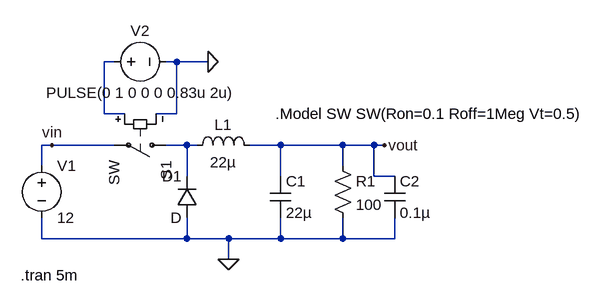
[diagram p0: schematic buck_converter_ideal_SW.asc]
buck_converter_ideal_SW.asc, the LTspice schematic file:
Version 4
SHEET 1 928 680
WIRE 80 16 64 16
WIRE 176 16 160 16
WIRE 224 16 176 16
WIRE 64 96 64 16
WIRE 96 96 64 96
WIRE 176 96 176 16
WIRE 176 96 144 96
WIRE -16 144 -32 144
WIRE 80 144 -16 144
WIRE 192 144 160 144
WIRE 208 144 192 144
WIRE 336 144 288 144
WIRE 432 144 336 144
WIRE 480 144 432 144
WIRE 496 144 480 144
WIRE -32 176 -32 144
WIRE 432 176 432 144
WIRE 192 192 192 144
WIRE 336 192 336 144
WIRE 480 192 480 144
WIRE 512 192 480 192
WIRE -32 288 -32 256
WIRE 192 288 192 256
WIRE 192 288 -32 288
WIRE 256 288 192 288
WIRE 336 288 336 256
WIRE 336 288 256 288
WIRE 432 288 432 256
WIRE 432 288 336 288
WIRE 512 288 512 256
WIRE 512 288 432 288
WIRE 256 320 256 288
FLAG 256 320 0
FLAG -16 144 vin
FLAG 496 144 vout
FLAG 224 16 0
SYMBOL ind 192 160 R270
WINDOW 0 32 56 VTop 2
WINDOW 3 5 56 VBottom 2
SYMATTR InstName L1
SYMATTR Value 22µ
SYMATTR SpiceLine Rser=1
SYMBOL cap 320 192 R0
SYMATTR InstName C1
SYMATTR Value 22µ
SYMBOL voltage -32 160 R0
WINDOW 123 0 0 Left 2
WINDOW 39 0 0 Left 2
SYMATTR InstName V1
SYMATTR Value 12
SYMBOL voltage 64 16 R270
WINDOW 0 32 56 VTop 2
WINDOW 3 -32 56 VBottom 2
WINDOW 123 0 0 Left 2
WINDOW 39 0 0 Left 2
SYMATTR InstName V2
SYMATTR Value PULSE(0 1 0 0 0 0.83u 2u)
SYMBOL res 416 160 R0
SYMATTR InstName R1
SYMATTR Value 100
SYMBOL diode 208 256 R180
WINDOW 0 24 64 Left 2
WINDOW 3 24 0 Left 2
SYMATTR InstName D1
SYMBOL cap 496 192 R0
SYMATTR InstName C2
SYMATTR Value 0.1µ
SYMBOL sw 176 144 R90
SYMATTR InstName S1
TEXT -64 344 Left 2 !.tran 5m
TEXT 328 96 Left 2 !.Model SW SW(Ron=0.1 Roff=1Meg Vt=0.5)

The netlist it stands for:
* buck_converter_ideal_SW.asc
L1 N002 vout 22µ Rser=1
C1 vout 0 22µ
V1 vin 0 12
V2 N001 0 PULSE(0 1 0 0 0 0.83u 2u)
R1 vout 0 100
D1 0 N002 D
C2 vout 0 0.1µ
S1 N002 vin N001 0 SW
.model D D
.lib standard.dio
.tran 5m
.Model SW SW(Ron=0.1 Roff=1Meg Vt=0.5)
.backanno
.end